# Altium schematic sheet Power_Schematic.SchDoc
size A
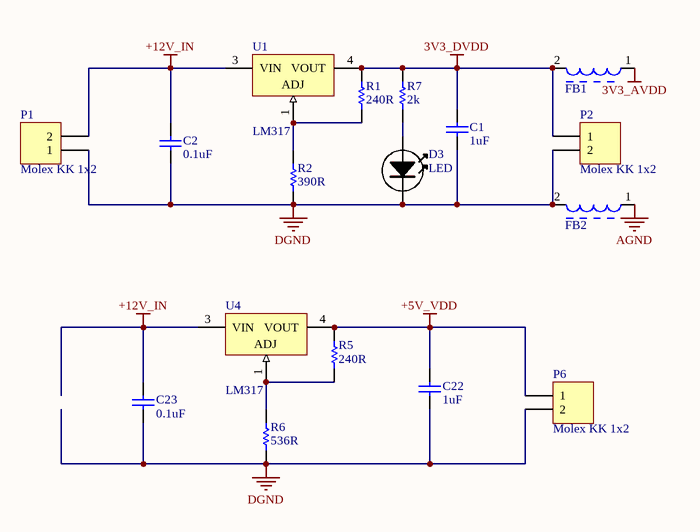
[diagram p0: Power_Schematic.SchDoc]

## Parts
C1  1uF  [C0805]
C2  0.1uF  [C0805]
C22  1uF  [C0805]
C23  0.1uF  [C0805]
D3  LED  [0805LED]
FB1  FERRITE  [R0805]  (value not drawn)
FB2  FERRITE  [R0805]  (value not drawn)
P1  Molex KK 1x2  [Molex KK 2x1]
P2  Molex KK 1x2  [Molex KK 2x1]
P6  Molex KK 1x2  [Molex KK 2x1]
R1  240R  [R0805]
R2  390R  [R0805]
R5  240R  [R0805]
R6  536R  [R0805]
R7  2k  [R0805]
U1  LM317  [D-PAK]
U4  LM317  [D-PAK]

## Nets
3V3_AVDD: FB1.1
3V3_DVDD: C1.1 FB1.2 P2.1 R1.2 R7.2 U1.4(VOUT)
+5V_VDD: C22.1 P6.1 R5.2 U4.4(VOUT)
+12V_IN: C2.1 C23.1 P1.2 U1.3(VIN) U4.3(VIN)
AGND: FB2.1
DGND: C1.2 C2.2 C22.2 C23.2 D3.K FB2.2 P1.1 P2.2 P6.2 R2.1 R6.1
NetD3_A: D3.A R7.1
NetR1_1: R1.1 R2.2 U1.1(ADJ)
NetR5_1: R5.1 R6.2 U4.1(ADJ)

## Library data of the parts
C1 C2 C22 C23 = C0805: 0805 Capacitor
  C1 C22: Value: 1uF
  C2 C23: Value: 0.1uF
D3 = LED: Manufacturer: OSRAM Opto Semiconductors Inc; Manufacturer Part Number: LS T676-Q1R2-1-Z; Reel: D13
FB1 FB2 = FERRITE: FERRITE BEAD 0805
P1 P2 P6 = Molex KK 1x2: 1x2 Molex KK Connector
R1 R2 R5-R7 = R0805: RESISTOR 0805
  R1 R5: Value: 240R
  R2: Value: 390R
  R6: Value: 536R
  R7: Value: 2k
U1 U4 = LM317: Linear Voltage Regulator